# Altium project ThrowBot_RX_Main_Board.PrjPcb
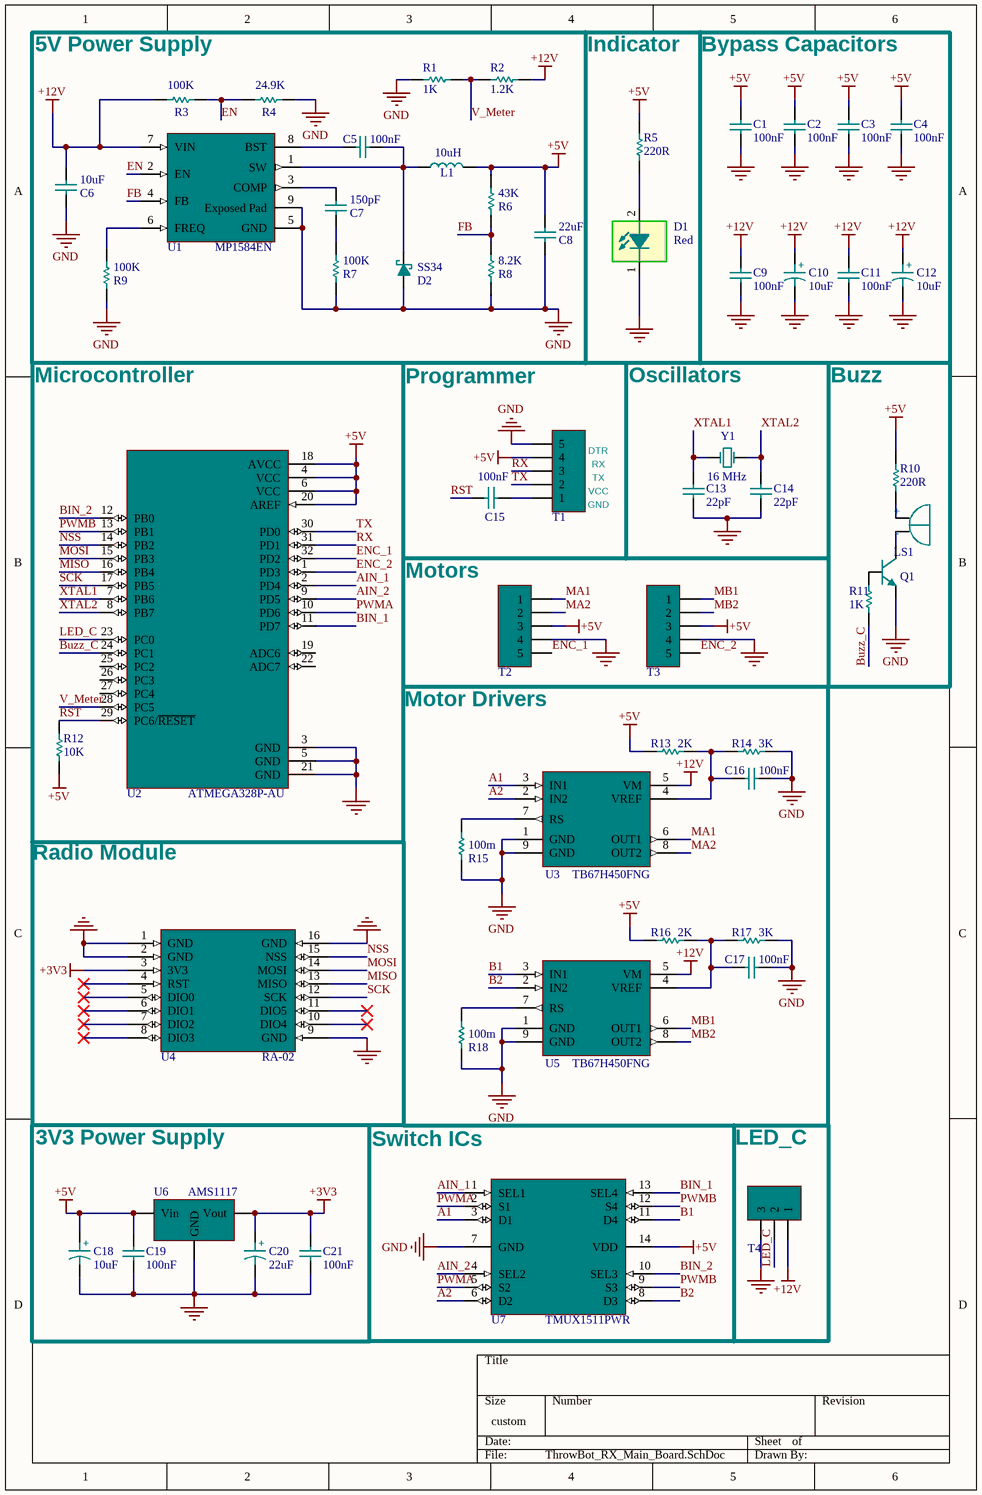
[diagram p0: ThrowBot_RX_Main_Board.SchDoc]
1 sheet, 56 parts. Net scope: global (net labels, ports and power ports of the same name join across sheets).
Board files: ThrowBot_RX_Main_Board.PcbDoc, Test_Board.PcbDoc

## Sheet ThrowBot_RX_Main_Board.SchDoc
size 182 x 279 mm; SheetNumber: 1; SheetTotal: 1

### Parts
C1  Val-1: 100nF  [CAP 1206]  (hidden comment: Cap)
C2  Val-1: 100nF  [CAP 1206]  (hidden comment: Cap)
C3  Val-1: 100nF  [CAP 1206]  (hidden comment: Cap)
C4  Val-1: 100nF  [CAP 1206]  (hidden comment: Cap)
C5  Val-1: 100nF  [CAP 1206]  (hidden comment: Cap)
C6  Val-4: 10uF  [CAP 1206]  (hidden comment: Cap)
C7  Val-5: 150pF  [CAP 1206]  (hidden comment: Cap)
C8  Val-3: 22uF  [CAP 1206]  (hidden comment: Cap)
C9  Val-1: 100nF  [CAP 1206]  (hidden comment: Cap)
C10  Val-1: 10uF  [CAP Tantalum Size B]  (hidden comment: Cap BiPolar)
C11  Val-1: 100nF  [CAP 1206]  (hidden comment: Cap)
C12  Val-1: 10uF  [CAP Tantalum Size B]  (hidden comment: Cap BiPolar)
C13  Val-2: 22pF  [CAP 1206]  (hidden comment: Cap)
C14  Val-2: 22pF  [CAP 1206]  (hidden comment: Cap)
C15  Val-1: 100nF  [CAP 1206]  (hidden comment: Cap)
C16  Val-1: 100nF  [CAP 1206]  (hidden comment: Cap)
C17  Val-1: 100nF  [CAP 1206]  (hidden comment: Cap)
C18  Val-1: 10uF  [CAP Tantalum Size B]  (hidden comment: Cap BiPolar)
C19  Val-1: 100nF  [CAP 1206]  (hidden comment: Cap)
C20  Val-1: 22uF  [CAP Tantalum Size B]  (hidden comment: Cap BiPolar)
C21  Val-1: 100nF  [CAP 1206]  (hidden comment: Cap)
D1  Color-2: Red  [LED 1206]  (hidden comment: LED)
D2  SS34  [SS34]
L1  value 10uH  [IND 10uH]  (hidden comment: Inductor)
LS1  Buzzer-5V  [Buzzer-5V]  (value not drawn)
Q1  BC847  [BC847-SOT23]  (value not drawn)
R1  Val-1: 1K  [RES 1206]  (hidden comment: Resistor)
R2  Val-12: 1.2K  [RES 1206]  (hidden comment: Resistor)
R3  Val-4: 100K  [RES 1206]  (hidden comment: Resistor)
R4  Val-5: 24.9K  [RES 1206]  (hidden comment: Resistor)
R5  Val-3: 220R  [RES 1206]  (hidden comment: Resistor)
R6  Val-7: 43K  [RES 1206]  (hidden comment: Resistor)
R7  Val-4: 100K  [RES 1206]  (hidden comment: Resistor)
R8  Val-6: 8.2K  [RES 1206]  (hidden comment: Resistor)
R9  Val-4: 100K  [RES 1206]  (hidden comment: Resistor)
R10  Val-3: 220R  [RES 1206]  (hidden comment: Resistor)
R11  Val-1: 1K  [RES 1206]  (hidden comment: Resistor)
R12  Val-2: 10K  [RES 1206]  (hidden comment: Resistor)
R13  Val-11: 2K  [RES 1206]  (hidden comment: Resistor)
R14  Val-10: 3K  [RES 1206]  (hidden comment: Resistor)
R15  Val-9: 100m  [RES 1206]  (hidden comment: Resistor)
R16  Val-11: 2K  [RES 1206]  (hidden comment: Resistor)
R17  Val-10: 3K  [RES 1206]  (hidden comment: Resistor)
R18  Val-9: 100m  [RES 1206]  (hidden comment: Resistor)
T1  5 Pin Socket  [XH-5AW]  (value not drawn)
T2  5 Pin Socket  [XH-5AW]  (value not drawn)
T3  5 Pin Socket  [XH-5AW]  (value not drawn)
T4  3 Pin Socket  [XH-3AW]  (value not drawn)
U1  MP1584EN  [MP1584EN]
U2  ATMEGA328P-AU  [ATmega328]
U3  TB67H450FNG  [TB67H450FNG]
U4  RA-02  [RA-02]
U5  TB67H450FNG  [TB67H450FNG]
U6  AMS1117  [AMS1117]
U7  TMUX1511PWR  [TMUX1511PWR]
Y1  Val-2: 16 MHz  [Crystal-5032]  (hidden comment: XTAL)

### Blocks framed on the sheet
5V Power Supply: C5-C8 D2 L1 R1-R4 R6-R9 U1

### Nets
+3V3: C20.1 C21.1 U4.3(3V3) U6.2(Vout)
+5V: C1.1 C2.1 C3.1 C4.1 C8.2 C18.1 C19.1 L1.2 R5.2 R6.2 R10.2 R12.2 R13.2 R16.2 T1.4 T2.3 T3.3 U2.4(VCC) U2.6(VCC) U2.18(AVCC) U2.20(AREF) U6.3(Vin) U7.14(VDD)
+12V: C6.2 C9.1 C10.1 C11.1 C12.1 R2.2 R3.2 T4.1 U1.7(VIN) U3.5(VM) U5.5(VM)
GND: C1.2 C2.2 C3.2 C4.2 C6.1 C8.1 C9.2 C10.2 C11.2 C12.2 C13.1 C14.1 C16.2 C17.2 C18.2 C19.2 C20.2 C21.2 D1.1 D2.1(A) Q1.2(E) R1.1 R4.2 R7.1 R8.1 R9.1 R14.1 R15.1 R17.1 R18.1 T1.5 T2.4 T3.4 T4.3 U1.5(GND) U1.9(Exposed_Pad) U2.3(GND) U2.5(GND) U2.21(GND) U3.1(GND) U3.9(GND) U4.1(GND) U4.2(GND) U4.9(GND) U4.16(GND) U5.1(GND) U5.9(GND) U6.1(GND) U7.7(GND)
A1: U3.3(IN1) U7.3(D1)
A2: U3.2(IN2) U7.6(D2)
AIN_1: U2.2(PD4) U7.1(SEL1)
AIN_2: U2.9(PD5) U7.4(SEL2)
B1: U5.3(IN1) U7.11(D4)
B2: U5.2(IN2) U7.8(D3)
BIN_1: U2.11(PD7) U7.13(SEL4)
BIN_2: U2.12(PB0) U7.10(SEL3)
Buzz_C: R11.1 U2.24(PC1)
EN: R3.1 R4.1 U1.2(EN)
ENC_1: T2.5 U2.32(PD2)
ENC_2: T3.5 U2.1(PD3)
FB: R6.1 R8.2 U1.4(FB)
LED_C: T4.2 U2.23(PC0)
MA1: T2.1 U3.6(OUT1)
MA2: T2.2 U3.8(OUT2)
MB1: T3.1 U5.6(OUT1)
MB2: T3.2 U5.8(OUT2)
MISO: U2.16(PB4) U4.13(MISO)
MOSI: U2.15(PB3) U4.14(MOSI)
NSS: U2.14(PB2) U4.15(NSS)
PWMA: U2.10(PD6) U7.2(S1) U7.5(S2)
PWMB: U2.13(PB1) U7.9(S3) U7.12(S4)
RST: C15.1 R12.1 U2.29(PC6/~{RESET})
RX: T1.3 U2.31(PD1)
SCK: U2.17(PB5) U4.12(SCK)
TX: T1.2 U2.30(PD0)
V_Meter: R1.2 R2.1 U2.28(PC5)
XTAL1: C13.2 U2.7(PB6) Y1.1(OSC1)
XTAL2: C14.2 U2.8(PB7) Y1.2(OSC2)
NetC5_1: C5.1 D2.2(K) L1.1 U1.1(SW)
NetC5_2: C5.2 U1.8(BST)
NetC7_1: C7.1 R7.2
NetC7_2: C7.2 U1.3(COMP)
NetC15_2: C15.2 T1.1
NetC16_1: C16.1 R13.1 R14.2 U3.4(VREF)
NetC17_1: C17.1 R16.1 R17.2 U5.4(VREF)
NetD1_2: D1.2 R5.1
NetLS1_N: LS1.N(NEG) Q1.3(C)
NetLS1_P: LS1.P(POS) R10.1
NetQ1_1: Q1.1(B) R11.2
NetR9_2: R9.2 U1.6(FREQ)
NetR15_2: R15.2 U3.7(RS)
NetR18_2: R18.2 U5.7(RS)

Not connected (* = marked no-connect by the designer): U2 19(ADC6) 22(ADC7) 25(PC2) 26(PC3) 27(PC4); U4 4(RST)* 5(DIO0)* 6(DIO1)* 7(DIO2)* 8(DIO3)* 10(DIO4)* 11(DIO5)*

### Notes on the sheet
- Indicator
- Bypass Capacitors
- Microcontroller
- Oscillators
- Buzz
- Programmer
- (near T1) DTR
- (near T1) RX
- (near T1) TX
- (near T1) VCC
- (near T1) GND
- Motors
- (near T2) Motor Drivers
- Radio Module
- 3V3 Power Supply
- (near U7) Switch ICs
- LED_C
- (in symbol Buzzer-5V) +; -
- (in symbol Cap BiPolar) +

### Library data of the parts
C1 = Cap: AVCC Cap; Val-2: 22pF; Val-3: 22uF
C2 C3 = Cap: VCC Cap; Val-2: 22pF; Val-3: 22uF
C4 = Cap: AREF Cap; Val-2: 22pF; Val-3: 22uF
C5 = Cap: 1206 Capacitor; Val-2: 22pF; Val-3: 22uF; Val-4: 10uF50V
C6 = Cap: 1206 Capacitor; Val-1: 100nF; Val-2: 22pF; Val-3: 22uF; Val-5: 150pF
C7 = Cap: 1206 Capacitor; Val-1: 100nF; Val-2: 22pF; Val-3: 22uF; Val-4: 10uF
C8 = Cap: 1206 Capacitor; Val-1: 100nF; Val-2: 22pF; Val-4: 10uF; Val-5: 150pF
C9 C11 = Cap: Motor Power Cap; Val-2: 22pF; Val-3: 22uF
C10 C12 = Cap BiPolar: Motor Power Cap; Val-2: 100uF; Val-3: 1000uF
C13 C14 = Cap: 1206 Capacitor; Val-1: 100nF; Val-3: 22uF
C15 = Cap: Programmer Cap; Val-2: 22pF; Val-3: 22uF
C16 C17 = Cap: Motor Driver Cap; Val-2: 22pF; Val-3: 22uF
C18 C20 = Cap BiPolar: 3.3V Regulator Cap; Val-2: 100uF; Val-3: 1000uF
C19 C21 = Cap: 3.3V Regulator Cap; Val-2: 22pF; Val-3: 22uF
D1 = LED: Color-1: Blue; Color-3: Green; Color-4: White
D2 = SS34: Diode Schottky 40 V 3A Surface Mount SMA; MF: MDD; SnapEDA_Link: https://www.snapeda.com/parts/SS34/MDD/view-part/?ref=snap; Package: None; Value: *; MP: SS34; Check_prices: https://www.snapeda.com/parts/SS34/MDD/view-part/?ref=eda
L1 = Inductor: Code_IEC: 1005; Published: 8-Jun-2000; LatestRevisionDate: 29-May-2009; LatestRevisionNote: IPC-7351 Footprint Added.; PackageReference: 0402-A; Publisher: Altium Limited; PackageDescription: Chip Inductor; Code_JEITA: 0402
Q1 = BC847: NPN General-purpose Transistor; Designer: Abbas Basereh; Desc.: Plastic Medium-Power. Silicon NPN Transistors; Data: 27-12-2016
R1 R11 = Resistor: Val-2: 10K; Val-3: 220R; Val-4: 100K; Val-5: 24.9K; Val-6: 8.2K; Val-7: 43K; Val-8: 150R; Val-9: 100m; Val-10: 6K; Val-11: 4K; Val-12: 1.2K
R2 = Resistor: Val-1: 1K; Val-2: 10K; Val-3: 220R; Val-4: 100K; Val-5: 24.9K; Val-6: 8.2K; Val-7: 43K; Val-8: 150R; Val-9: 100m; Val-10: 6K; Val-11: 4K
R3 R7 R9 = Resistor: Val-1: 1K; Val-2: 10K; Val-3: 220R; Val-5: 24.9K; Val-6: 8.2K; Val-7: 43K
R4 = Resistor: Val-1: 1K; Val-2: 10K; Val-3: 220R; Val-4: 100K; Val-6: 8.2K; Val-7: 43K
R5 = Resistor: Val-1: 1K; Val-2: 10K
R6 = Resistor: Val-1: 1K; Val-2: 10K; Val-3: 220R; Val-4: 100K; Val-5: 24.9K; Val-6: 8.2K
R8 = Resistor: Val-1: 1K; Val-2: 10K; Val-3: 220R; Val-4: 100K; Val-5: 24.9K; Val-7: 43K
R10 = Resistor: Val-1: 1K; Val-2: 10K; Val-4: 100K; Val-5: 24.9K; Val-6: 8.2K; Val-7: 43K; Val-8: 150R; Val-9: 100m; Val-10: 6K; Val-11: 4K; Val-12: 1.2K
R12 = Resistor: Val-1: 1K; Val-3: 220R
R13 R16 = Resistor: Val-1: 1K; Val-2: 10K; Val-3: 220R; Val-4: 100K; Val-5: 24.9K; Val-6: 8.2K; Val-7: 43K; Val-8: 150R; Val-9: 100m; Val-10: 6K
R14 R17 = Resistor: Val-1: 1K; Val-2: 10K; Val-3: 220R; Val-4: 100K; Val-5: 24.9K; Val-6: 8.2K; Val-7: 43K; Val-8: 150R; Val-9: 100m; Val-11: 4K
R15 R18 = Resistor: Val-1: 1K; Val-2: 10K; Val-3: 220R; Val-4: 100K; Val-5: 24.9K; Val-6: 8.2K; Val-7: 43K; Val-8: 150R; Val-10: 6K; Val-11: 4K
U1 = MP1584EN: Buck Switching Regulator IC Positive Adjustable 0.8V 1 Output 3A 8-SOIC (0.154, 3.90mm Width) Exposed Pad; MF: Monolithic Power; Value: *; SnapEDA_Link: https://www.snapeda.com/parts/MP1584EN/Monolithic+Power+Systems+Inc./view-part/?ref=snap; MP: MP1584EN; Purchase-URL: https://pricing.snapeda.com/search/part/MP1584EN/?ref=eda; Check_prices: https://www.snapeda.com/parts/MP1584EN/Monolithic+Power+Systems+Inc./view-part/?ref=eda; Availability: In Stock; Price: None; Package: SOIC-8 Monolithic Power
U2 = ATMEGA328P-AU: ATmega 328 Microcontroller
U3 U5 = TB67H450FNG: Motor Driver
U4 = RA-02: LoRa RA-02
U6 = AMS1117: 3V3 Regulator
Y1 = XTAL: XTAL Crystal; Val-1: 12 MHz
U7 = TMUX1511PWR: Package: None; Price: None; Value: *; MP: TMUX1511PWR; Availability: Unavailable